# EAGLE design Pulse Ox PCB board (EAGLE 9.6.2)
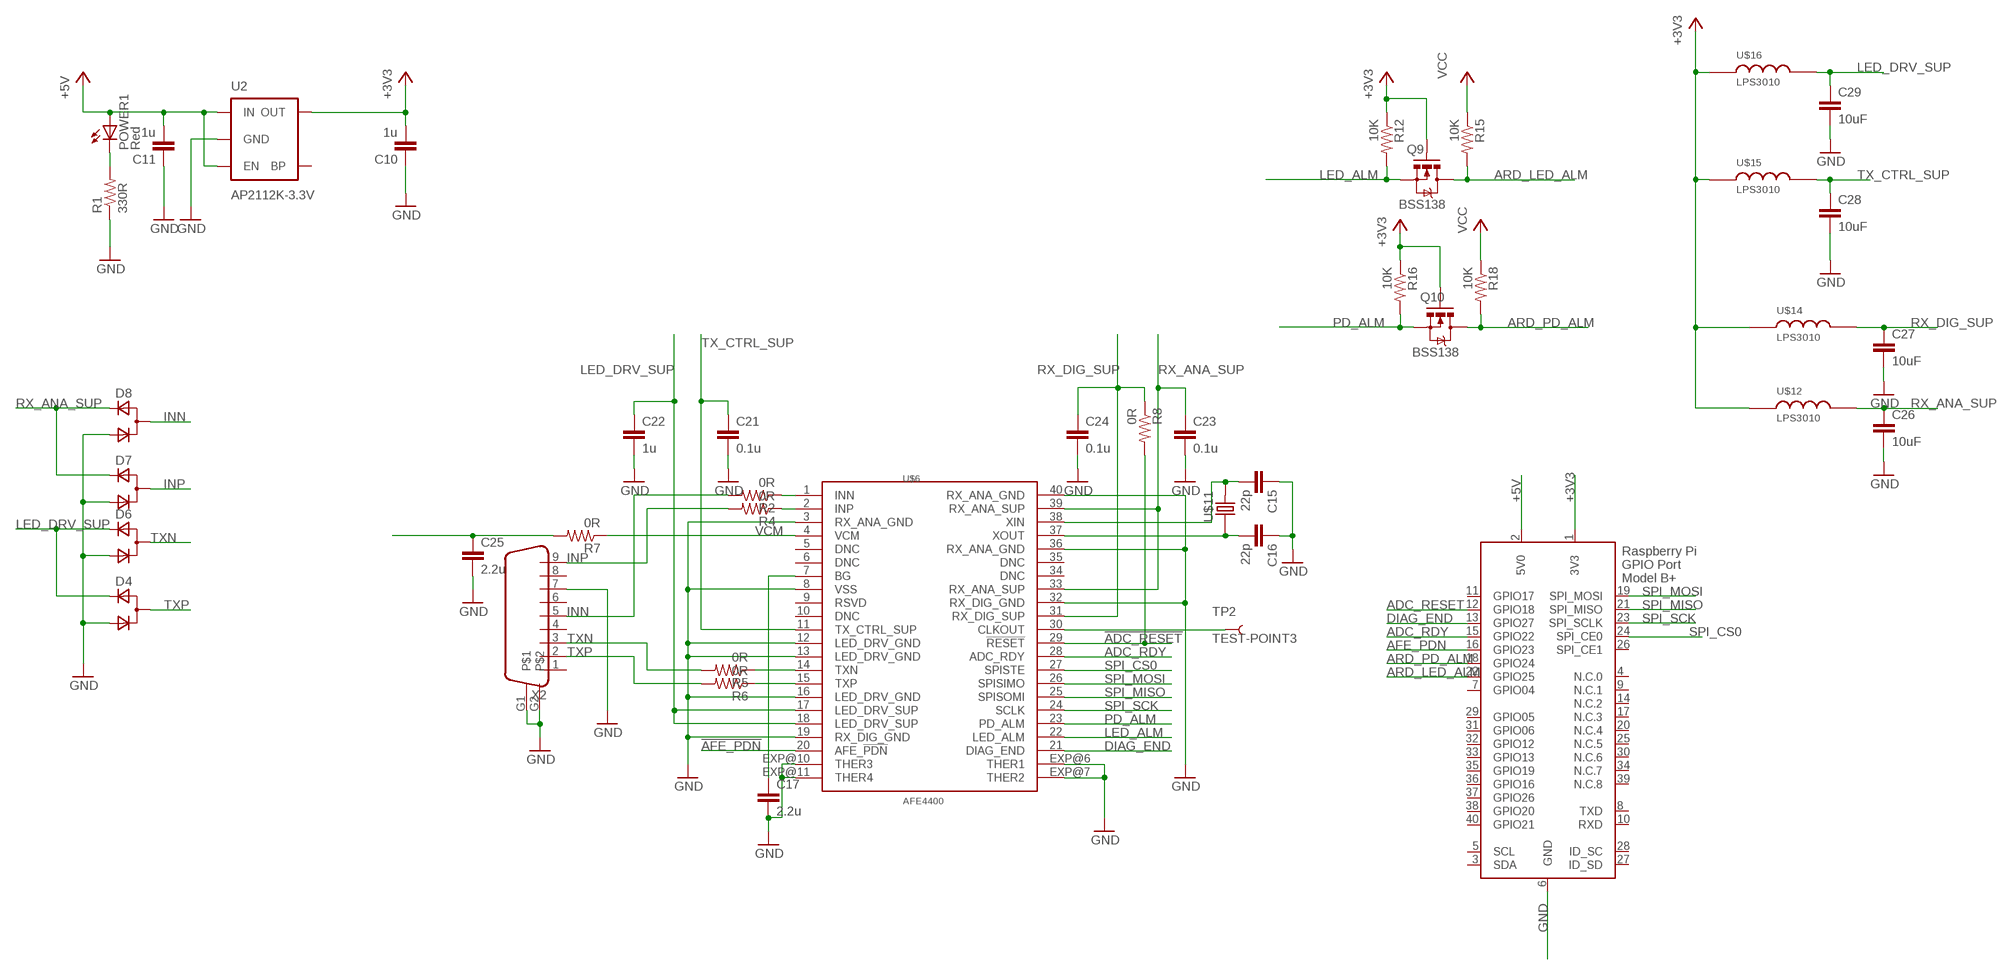
[diagram p0: schematic, sheet 1]

## Parts
C10  1u  C-EUC0805  [C0805]
C11  1u  C-EUC0805  [C0805]
C15  22p  C-EUC0402  [C0402]
C16  22p  C-EUC0402  [C0402]
C17  2.2u  C-EUC0402  [C0402]
C21  0.1u  C-EUC0805  [C0805]
C22  1u  C-EUC0805  [C0805]
C23  0.1u  C-EUC0805  [C0805]
C24  0.1u  C-EUC0805  [C0805]
C25  2.2u  C-EUC0402  [C0402]
C26  10uF  C-EUC0805  [C0805]
C27  10uF  C-EUC0805  [C0805]
C28  10uF  C-EUC0805  [C0805]
C29  10uF  C-EUC0805  [C0805]
D4  D_ACACSOT323  [SOT323]
D6  D_ACACSOT323  [SOT323]
D7  D_ACACSOT323  [SOT323]
D8  D_ACACSOT323  [SOT323]
POWER1  Red  LEDCHIPLED_0603  [CHIPLED_0603]
Q9  BSS138  MOSFET-NCHANNELSMD  [SOT23-3]
Q10  BSS138  MOSFET-NCHANNELSMD  [SOT23-3]
R1  330R  R-US_R0805  [R0805]
R2  0R  R-US_R0402  [R0402]
R4  0R  R-US_R0402  [R0402]
R5  0R  R-US_R0805  [R0805]
R6  0R  R-US_R0805  [R0805]
R7  0R  R-US_R0402  [R0402]
R8  0R  R-US_R0805  [R0805]
R12  10K  RESISTOR0805-RES  [0805]
R15  10K  RESISTOR0805-RES  [0805]
R16  10K  RESISTOR0805-RES  [0805]
R18  10K  RESISTOR0805-RES  [0805]
TP2  TEST-POINT3  [PAD.03X.03]
U2  AP2112K-3.3V  V_REG_LDOSMD  [SOT23-5]
U$6  AFE4400  [QFN-40]
U$11  ABM3  [ABM3]
U$12  LPS3010  LPS  [LPS]
U$14  LPS3010  LPS  [LPS]
U$15  LPS3010  LPS  [LPS]
U$16  LPS3010  LPS  [LPS]
X2  DB9  [DB9]
X3  RASPI_BOARD_B+_HD  [RASPI_BOARD_B+HAT_DF]

## Nets
!ADC_RESET: R8.2 U$6.29(!RESET)
!AFE_PDN: U$6.20(AFE_!PDN)
+3V3: C10.2 Q9.1(G) Q10.1(G) R12.1 R16.1 U2.5(OUT) U$12.1 U$14.1 U$15.1 U$16.1 X3.1(3V3)
+5V: C11.2 POWER1.A U2.1(IN) U2.3(EN) X3.2(5V0)
ADC_RDY: U$6.28(ADC_RDY) X3.15(GPIO22)
ADC_RESET: X3.12(GPIO18)
AFE_PDN: X3.16(GPIO23)
ARD_LED_ALM: Q9.3(D) R15.2 X3.22(GPIO25)
ARD_PD_ALM: Q10.3(D) R18.2 X3.18(GPIO24)
DIAG_END: U$6.21(DIAG_END) X3.13(GPIO27)
GND: C10.1 C11.1 C15.1 C16.1 C17.2 C21.2 C22.2 C23.2 C24.2 C25.2 C26.2 C27.2 C28.2 C29.2 D4.2(C) D6.2(C) D7.2(C) D8.2(C) R1.1 U2.2(GND) U$6.3(RX_ANA_GND) U$6.8(VSS) U$6.12(LED_DRV_GND) U$6.13(LED_DRV_GND) U$6.16(LED_DRV_GND) U$6.19(RX_DIG_GND) U$6.32(RX_DIG_GND) U$6.36(RX_ANA_GND) U$6.40(RX_ANA_GND) U$6.EXP@6(THER1) U$6.EXP@7(THER2) U$6.EXP@10(THER3) U$6.EXP@11(THER4) X2.7 X2.G1 X2.G2 X3.6(GND)
INN: D8.1(CA) R2.2 X2.5
INP: D7.1(CA) R4.2 X2.9
LED_ALM: Q9.2(S) R12.2 U$6.22(LED_ALM)
LED_DRV_SUP: C22.1 C29.1 D4.3(A) D6.3(A) U$6.17(LED_DRV_SUP) U$6.18(LED_DRV_SUP) U$16.2
N$15: POWER1.C R1.2
N$16: C15.2 U$6.38(XIN) U$11.2
N$19: C16.2 U$6.37(XOUT) U$11.1
N$20: C17.1 U$6.7(BG)
N$22: TP2.P$1 U$6.30(CLKOUT)
N$23: R2.1 U$6.1(INN)
N$24: R4.1 U$6.2(INP)
N$27: C25.1 R7.2
P14: R5.1 U$6.14(TXN)
P15: R6.1 U$6.15(TXP)
PD_ALM: Q10.2(S) R16.2 U$6.23(PD_ALM)
RX_ANA_SUP: C23.1 C26.1 D7.3(A) D8.3(A) U$6.33(RX_ANA_SUP) U$6.39(RX_ANA_SUP) U$12.2
RX_DIG_SUP: C24.1 C27.1 R8.1 U$6.31(RX_DIG_SUP) U$14.2
SPI_CS0: U$6.27(SPISTE) X3.24(SPI_CE0)
SPI_MISO: U$6.25(SPISOMI) X3.21(SPI_MISO)
SPI_MOSI: U$6.26(SPISIMO) X3.19(SPI_MOSI)
SPI_SCK: U$6.24(SCLK) X3.23(SPI_SCLK)
TX_CTRL_SUP: C21.1 C28.1 U$6.11(TX_CTRL_SUP) U$15.2
TXN: D6.1(CA) R5.2 X2.3
TXP: D4.1(CA) R6.2 X2.2
VCC: R15.1 R18.1
VCM: R7.1 U$6.4(VCM)
Unconnected: U2.4(BP) U$6.5(DNC) U$6.6(DNC) U$6.9(RSVD) U$6.10(DNC) U$6.34(DNC) U$6.35(DNC) X2.1 X2.4 X2.6 X2.8 X3.3(SDA) X3.4(N.C.0) X3.5(SCL) X3.7(GPIO04) X3.8(TXD) X3.9(N.C.1) X3.10(RXD) X3.11(GPIO17) X3.14(N.C.2) X3.17(N.C.3) X3.20(N.C.4) X3.25(N.C.5) X3.26(SPI_CE1) X3.27(ID_SD) X3.28(ID_SC) X3.29(GPIO05) X3.30(N.C.6) X3.31(GPIO06) X3.32(GPIO12) X3.33(GPIO13) X3.34(N.C.7) X3.35(GPIO19) X3.36(GPIO16) X3.37(GPIO26) X3.38(GPIO20) X3.39(N.C.8) X3.40(GPIO21)

## Library data of the parts
C10 C11 C15-C17 C21-C29 = rcl:C-EU: CAPACITOR, European symbol
D4 D6-D8 = zetex:D_ACAC: Dual DIODE; OC_FARNELL: unknown; OC_NEWARK: unknown
POWER1 = led:LED: LED OSRAM: - CHIPLED LG R971, LG N971, LY N971, LG Q971, LY Q971, LO R971, LY R971 LH N974, LH R974 LS Q976, LO Q976, LY Q976 LO Q996 - Hyper CHIPLED LW Q18S LB Q993, LB Q99A, LB R99A - SideLED LS A670, LO A670, LY A670, LG A670, LP A670 LB A673, LV A673, LT A673, LW A673 LH A674 LY A675 LS A676, LA A676, LO A676, LY A676, LW A676 LS A679, LY A679, LG A679 - Hyper Micro SIDELED® LS Y876, LA Y876, LO Y876, LY Y876 LT Y87S - SmartLED LW L88C, LW L88S LB L89C, LB L89S, LG L890 LS L89K, LO L89K, LY L89K LS L896, LA L896, LO L896, LY L896 - TOPLED LS T670, LO T670, LY T670, LG T670, LP T670 LSG T670, LSP T670, LSY T670, LOP T670, LYG T670 LG T671, LOG T671, LSG T671 LB T673, LV T673, LT T673, LW T673 LH T674 LS T676, LA T676, LO T676, LY T676, LB T676, LH T676, LSB T676, LW T676 LB T67C, LV T67C, LT T67C, LS T67K, LO T67K, LY T67K, LW E67C LS E67B, LA E67B, LO E67B, LY E67B, LB E67C, LV E67C, LT E67C LW T67C LS T679, LY T679, LG T679 LS T770, LO T770, LY T770, LG T770, LP T770 LB T773, LV T773, LT T773, LW T773 LH T774 LS E675, LA E675, LY E675, LS T675 LS T776, LA T776, LO T776, LY T776, LB T776 LHGB T686 LT T68C, LB T68C - Hyper Mini TOPLED® LB M676 - Mini TOPLED Santana® LG M470 LS M47K, LO M47K, LY M47K Source: http://www.osram.convergy.de LUXEON: - LUMILED® LXK2-PW12-R00, LXK2-PW12-S00, LXK2-PW14-U00, LXK2-PW14-V00 LXK2-PM12-R00, LXK2-PM12-S00, LXK2-PM14-U00 LXK2-PE12-Q00, LXK2-PE12-R00, LXK2-PE12-S00, LXK2-PE14-T00, LXK2-PE14-U00 LXK2-PB12-K00, LXK2-PB12-L00, LXK2-PB12-M00, LXK2-PB14-N00, LXK2-PB14-P00, LXK2-PB14-Q00 LXK2-PR12-L00, LXK2-PR12-M00, LXK2-PR14-Q00, LXK2-PR14-R00 LXK2-PD12-Q00, LXK2-PD12-R00, LXK2-PD12-S00 LXK2-PH12-R00, LXK2-PH12-S00 LXK2-PL12-P00, LXK2-PL12-Q00, LXK2-PL12-R00 Source: www.luxeon.com KINGBRIGHT: KA-3528ASYC Source: www.kingbright.com
Q9 Q10 = SparkFun:MOSFET-NCHANNEL
R1 R2 R4-R8 = rcl:R-US_: RESISTOR, American symbol
R12 R15 R16 R18 = SparkFun:RESISTOR: Resistor Basic schematic elements and footprints for 0603, 1206, and PTH resistors.
TP2 = SparkFun:TEST-POINT
U2 = SparkFun-PowerIC:V_REG_LDO: Voltage Regulator LDO Standard 150mA LDO voltage regulator in SOT-23 layout. Micrel part MIC5205. BP (by-pass) pin is used to lower output noise with 470pF cap.; PROD_ID: VREG-12457
U$6 = circuitects:AFE4400
U$11 = circuitects:ABM3
U$12 U$14-U$16 = circuitects:LPS
X2 = circuitects:DB9: DB9 Connector Standard DB9 (D-Sub 9) serial connector. Can be used for CAN bus as well as RS485 and RS232. Footprint production proven. Spark Fun Electronics SKU : PRT-00429
X3 = raspberrypi_bastelstube_v13:RASPI_BOARD_B+: Raspberry Pi GPIO connector with markings for the outer dimensions of the Raspberry Pi board model B+ with different sets of drill holes or mounting pads

## Board
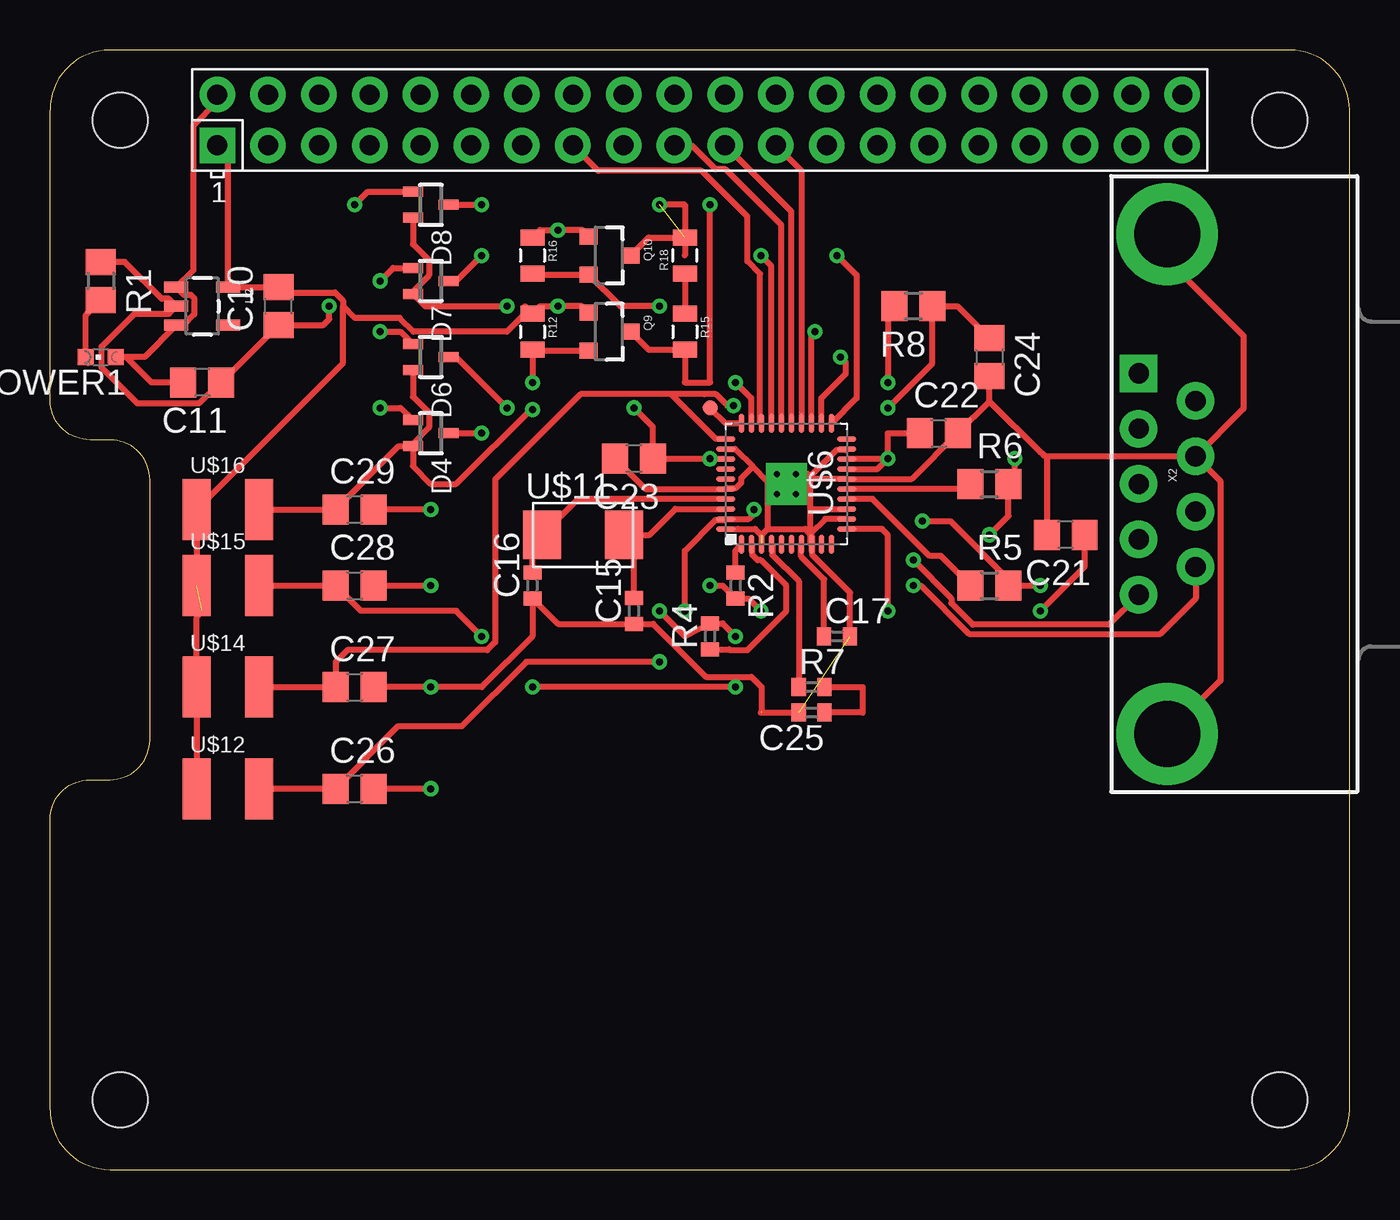
[diagram p1: board, top side]
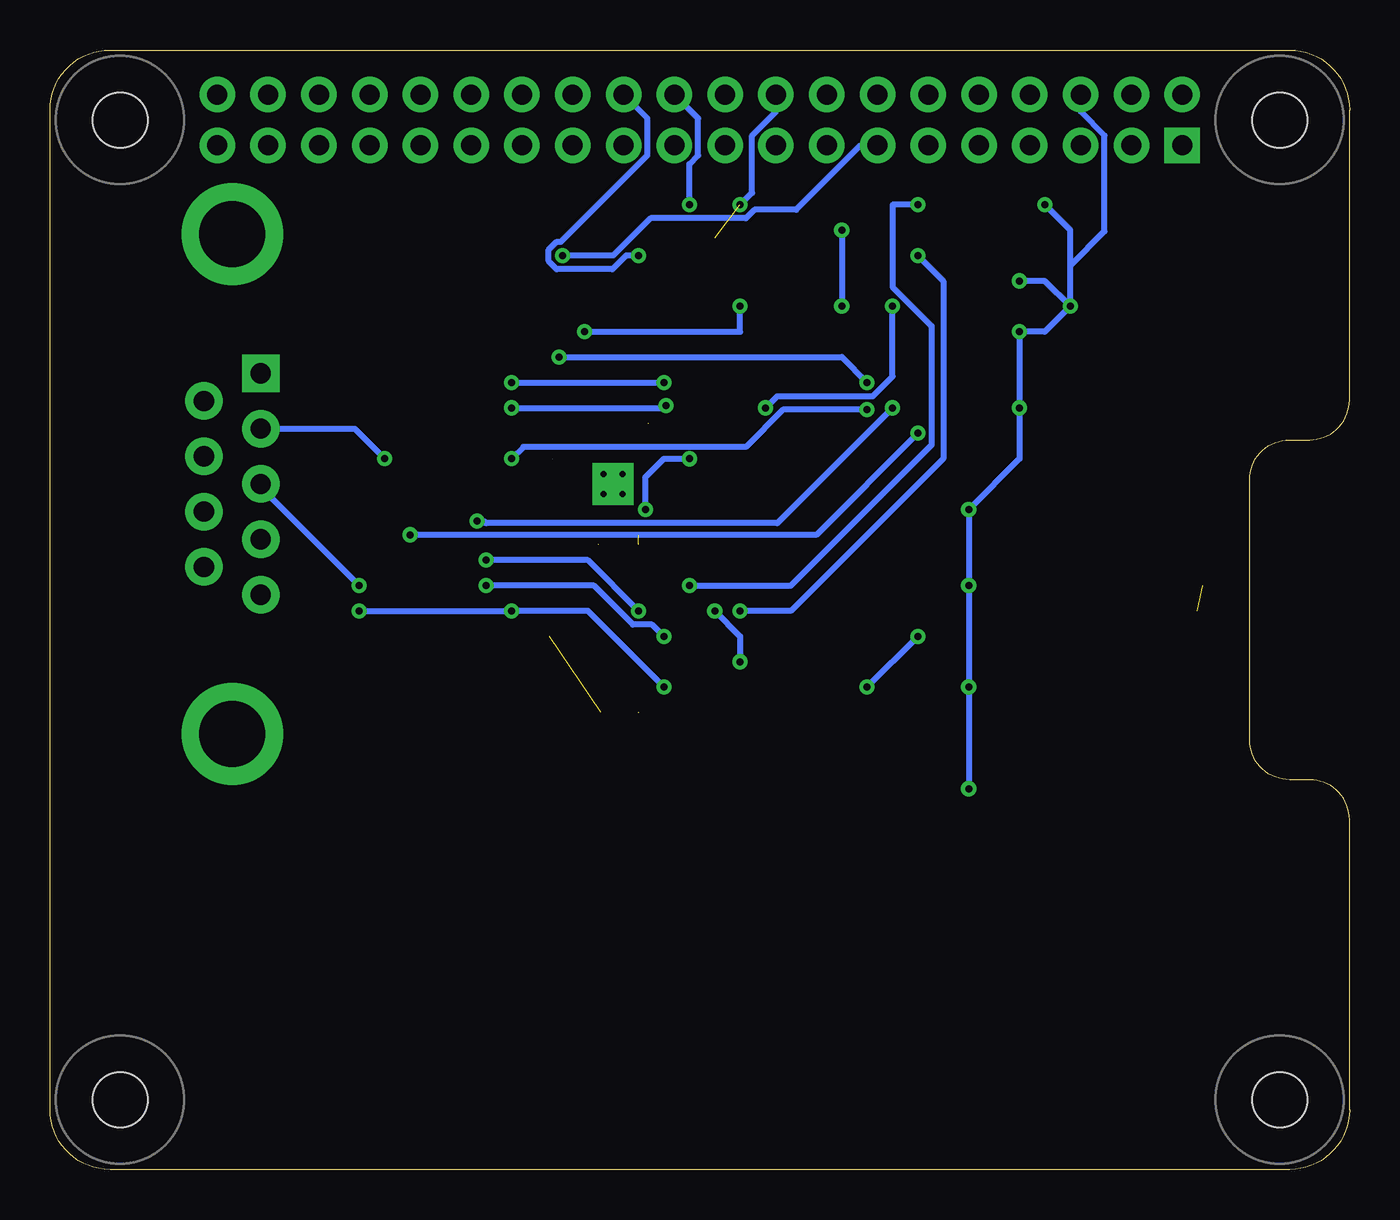
[diagram p2: board, bottom side, seen from below]

Size 65 x 56 mm. Coordinates in mm from the lower left corner, seen from the top.
Copper layers (1*16): Top 0.035mm / dielectric 1.5mm / Bottom 0.035mm
Design rules "default": minimum track width 6mil, minimum drill 0.35mm, track to track 6mil, track to pad 6mil, pad to pad 6mil, via to via 6mil, smd to smd 6mil, copper to edge 40mil, drill to drill 6mil, minimum pad ring 10mil, minimum via ring 8mil, stop-mask expansion 4mil, vias tented up to drill 0mil, thermal gap 10mil

### Footprints (pad centres in the part's own frame; a part is rotated, then mirrored left to right if it is on the bottom)
C0805 = smd 1.3 x 1.5: 1 -0.95,0; 2 0.95,0
C0402 = smd 0.7 x 0.9: 1 -0.65,0; 2 0.65,0
SOT323 = smd 0.5 x 1: 1 0,0.9; 2 -0.65,-0.9; 3 0.65,-0.9
CHIPLED_0603 = smd 0.8 x 0.8: A 0,-0.75; C 0,0.75
SOT23-3 = smd 0.8 x 0.9: 1 -0.95,-1; 2 0.95,-1; 3 0,1.1
R0805 = smd 1.3 x 1.5: 1 -0.95,0; 2 0.95,0
R0402 = smd 0.7 x 0.9: 1 -0.65,0; 2 0.65,0
0805 = smd 0.8 x 1.2: 1 -0.9,0; 2 0.9,0
PAD.03X.03 = smd 0.762 x 0.762: P$1 0,0
SOT23-5 = smd 0.55 x 1.2: 1 -0.95,-1.3; 2 0,-1.3; 3 0.95,-1.3; 4 0.95,1.3; 5 -0.95,1.3
QFN-40 = smd 0.95 x 0.28: 1 -3.025,2.25; 2 -3.025,1.75; 3 -3.025,1.25; 4 -3.025,0.75; 5 -3.025,0.25; 6 -3.025,-0.25; 7 -3.025,-0.75; 8 -3.025,-1.25; 9 -3.025,-1.75; 10 -3.025,-2.25; 21 3.025,-2.25; 22 3.025,-1.75; 23 3.025,-1.25; 24 3.025,-0.75; 25 3.025,-0.25; 26 3.025,0.25; 27 3.025,0.75; 28 3.025,1.25; 29 3.025,1.75; 30 3.025,2.25 | smd 0.28 x 0.95: 11 -2.25,-3.025; 12 -1.75,-3.025; 13 -1.25,-3.025; 14 -0.75,-3.025; 15 -0.25,-3.025; 16 0.25,-3.025; 17 0.75,-3.025; 18 1.25,-3.025; 19 1.75,-3.025; 20 2.25,-3.025; 31 2.25,3.025; 32 1.75,3.025; 33 1.25,3.025; 34 0.75,3.025; 35 0.25,3.025; 36 -0.25,3.025; 37 -0.75,3.025; 38 -1.25,3.025; 39 -1.75,3.025; 40 -2.25,3.025 | drill 0.3 pad 1.1 square: EXP@6 -0.5,0.475; EXP@7 0.5,0.475; EXP@10 -0.5,-0.475; EXP@11 0.5,-0.475
ABM3 = smd 1.9 x 2.4: 1 -2.05,0; 2 2.05,0
LPS = smd 1.4 x 3.05: 1 -1.56,0; 2 1.56,0
DB9 = drill 1.016 pad 1.88 square: 1 -5.54,-1.42 | drill 1.016 pad 1.88: 2 -2.77,-1.42; 3 0,-1.42; 4 2.77,-1.42; 5 5.54,-1.42; 6 -4.15,1.42; 7 -1.38,1.42; 8 1.38,1.42; 9 4.15,1.42 | drill 3.302 pad 5.08: G1 -12.5,0; G2 12.5,0
RASPI_BOARD_B+HAT_DF = drill 1 pad 1.778 square: 1 8.37,51.23 | drill 1 pad 1.778: 2 8.37,53.77; 3 10.91,51.23; 4 10.91,53.77; 5 13.45,51.23; 6 13.45,53.77; 7 15.99,51.23; 8 15.99,53.77; 9 18.53,51.23; 10 18.53,53.77; 11 21.07,51.23; 12 21.07,53.77; 13 23.61,51.23; 14 23.61,53.77; 15 26.15,51.23; 16 26.15,53.77; 17 28.69,51.23; 18 28.69,53.77; 19 31.23,51.23; 20 31.23,53.77; 21 33.77,51.23; 22 33.77,53.77; 23 36.31,51.23; 24 36.31,53.77; 25 38.85,51.23; 26 38.85,53.77; 27 41.39,51.23; 28 41.39,53.77; 29 43.93,51.23; 30 43.93,53.77; 31 46.47,51.23; 32 46.47,53.77; 33 49.01,51.23; 34 49.01,53.77; 35 51.55,51.23; 36 51.55,53.77; 37 54.09,51.23; 38 54.09,53.77; 39 56.63,51.23; 40 56.63,53.77 | hole 2.75: 3.5,3.5; 3.5,52.5; 61.5,3.5; 61.5,52.5

### Placement (x,y rotation side)
C10  11.43,43.18 90 top
C11  7.62,39.37 180 top
C15  29.21,27.94 90 top
C16  24.13,29.21 90 top
C17  39.37,26.67 0 top
C21  50.8,31.75 180 top
C22  44.45,36.83 0 top
C23  29.21,35.56 180 top
C24  46.99,40.64 270 top
C25  38.1,22.86 180 top
C26  15.24,19.05 0 top
C27  15.24,24.13 0 top
C28  15.24,29.21 0 top
C29  15.24,33.02 0 top
D4  19.05,36.83 270 top
D6  19.05,40.64 270 top
D7  19.05,44.45 270 top
D8  19.05,48.26 270 top
POWER1  2.54,40.64 90 top
Q9  27.94,41.91 270 top
Q10  27.94,45.72 270 top
R1  2.54,44.45 270 top
R2  34.29,29.21 270 top
R4  33.02,26.67 90 top
R5  46.99,29.21 0 top
R6  46.99,34.29 0 top
R7  38.1,24.13 0 top
R8  43.18,43.18 180 top
R12  24.13,41.91 270 top
R15  31.75,41.91 270 top
R16  24.13,45.72 270 top
R18  31.75,45.72 90 top
TP2  33.02,38.1 0 top
U2  7.62,43.18 270 top
U$6  36.83,34.29 90 top
U$11  26.67,31.75 0 top
U$12  8.89,19.05 0 top
U$14  8.89,24.13 0 top
U$15  8.89,29.21 0 top
U$16  8.89,33.02 0 top
X2  55.88,34.29 270 top
X3  0,0 0 top

### Tracks (layer width: path | path; a pad name or v marks a point on that pad's centre or on a via)
!ADC_RESET  (via drill 0.35)  (1 unrouted)
  Top 0.305: v34.29,39.37 35.07,38.59 35.07,37.31 | R8.2 41.91,42.86 v41.91,39.37
  Bottom 0.305: v41.91,39.37 v34.29,39.37
+3V3  (via drill 0.35)  (1 unrouted)
  Top 0.305: X3.1 8.92,50.68 U2.5 C10.2 11.7,43.86 14.25,43.86 14.65,43.46 14.65,43.18 | U$15.1 U$16.1 14.65,40.34 14.65,43.18 | 7.62,27.94 7.33,27.65 U$14.1 U$12.1 | Q10.1 26.62,46.99 v25.4,46.99 24.5,46.99 R16.1 | Q9.1 26.62,43.18 v25.4,43.18 24.5,43.18 R12.1 | R12.1 23.76,43.18 | R12.1 23.76,42.81 22.86,41.91 18.18,41.91 17.49,42.59 15.24,42.59 14.65,43.18
  Bottom 0.305: v25.4,46.99 v25.4,43.18
+5V
  Top 0.305: X3.2 8.37,53.44 7.18,52.24 7.18,44.99 U2.1 6.69,43.76 7.05,43.76 7.23,43.58 7.23,42.78 6.68,42.23 U2.3 4.73,40.64 3.81,40.64 | 3.81,40.64 POWER1.A | C11.2 5.08,39.37 3.81,40.64
ADC_RDY
  Top 0.305: U$6.28 35.52,37.37 35.52,44.79 34.88,45.44 34.88,47.67 32.59,49.96 27.42,49.96 X3.15
ARD_LED_ALM  (via drill 0.35)
  Top 0.305: Q9.3 29.94,41.01 R15.2 31.75,39.37 33.02,39.37 v33.02,48.26
  Bottom 0.305: v33.02,48.26 33.02,50.29 32.58,50.74 32.58,52.58 X3.22
ARD_PD_ALM  (via drill 0.35)  (1 unrouted)
  Top 0.305: Q10.3 29.94,46.62 R18.2 | R18.2 31.75,45.72 | v30.48,48.26 31.75,48.26 R18.2
  Bottom 0.305: v30.48,48.26 29.88,48.86 29.88,51.72 28.69,52.92 X3.18
DIAG_END  (via drill 0.35)
  Top 0.305: v39.37,45.72 40.35,44.74 40.35,38.58 U$6.21
  Bottom 0.305: X3.13 24.46,51.23 27.69,48.01 29.77,48.01 30.2,47.58 34.97,47.58 36.83,45.72 v39.37,45.72
GND  (via drill 0.35)  (4 unrouted)
  Top 0.305: R1.1 3.74,45.4 5.59,43.55 5.95,43.55 U2.2 5.95,42.81 4.23,42.81 2.58,41.17 2.58,40.11 4.38,38.31 7.45,38.31 8.5,39.37 C11.1 C10.1 13.65,42.23 13.97,42.55 v13.97,43.18 | v15.24,48.26 15.89,48.91 D8.2 | v16.51,44.45 17.16,45.1 D7.2 | v16.51,41.91 17.53,41.91 D6.2 | v16.51,38.1 17.53,38.1 D4.2 | v19.05,33.02 C29.2 | C27.2 v19.05,24.13 21.59,24.13 24.13,26.67 C16.1 25.4,27.29 C15.1 30.16,27.29 32.81,24.64 35.08,24.64 35.59,24.13 35.59,22.89 | v19.05,19.05 C26.2 | 38.02,31.78 37.76,32.05 35.9,32.05 | 38.02,31.78 38.02,31.75 | 38.02,31.75 38.02,31.32 U$6.8 | 35.59,31.74 35.9,32.05 | 35.16,35.16 35.9,34.41 | 35.9,34.41 35.9,34.25 | 35.9,34.25 35.9,32.05 | U$6.19 39.8,35.98 39.34,35.98 38.02,34.67 | 38.02,34.67 38.02,34.29 | 38.02,34.29 38.02,33.02 | 38.02,33.02 38.02,31.78 | U$6.12 38.78,32.54 38.02,31.78 | U$6.13 39.83,33.02 38.02,33.02 | 38.02,34.67 38.16,34.54 U$6.16 43.11,34.54 C22.2 46.99,38.42 | C25.2 35.56,22.86 | 38.02,31.75 38.14,31.64 38.14,30.75 40.02,28.86 C17.2 | 35.16,35.16 34.59,34.58 34.59,34.36 34.32,34.09 33.86,34.09 U$6.36 29.78,34.04 C23.2 | U$6.32 34.27,36.04 35.16,35.16 | 46.99,38.42 C24.2 | 46.99,38.42 49.53,35.88 49.69,35.76 | C21.2 49.85,35.63 49.69,35.76 | C28.2 v19.05,29.21 | X2.7 49.77,35.67 49.69,35.76 | X2.G1 55.88,45.52 58.32,43.08 58.42,42.98 59.69,41.71 59.69,38.06 X2.7 | X2.G2 58.55,24.46 58.55,34.42 X2.7 | U$6.40 34.39,32.04 34.4,32.05 35.26,32.05 35.59,31.72 35.59,31.27 | U$6.EXP@7 35.98,34.41 35.9,34.41 | U$6.EXP@6 35.9,34.25 | U$6.EXP@11 37.91,34.79 38.02,34.67 | U$6.EXP@10 37.52,33.79 38.02,34.29
  Bottom 0.305: X3.6 13.45,52.92 12.26,51.72 12.26,46.93 13.97,45.21 v13.97,43.18 | v13.97,43.18 13.97,46.99 v15.24,48.26 | v13.97,43.18 15.24,44.45 v16.51,44.45 | v13.97,43.18 15.24,41.91 v16.51,41.91 v16.51,38.1 16.51,35.56 v19.05,33.02 v19.05,29.21 v19.05,24.13 v19.05,19.05
INN  (via drill 0.35)
  Top 0.305: D8.1 v21.59,48.26 | v33.02,29.21 33.64,29.21 R2.2 34.94,28.56 v35.56,27.94 | X2.5 52.97,27.26 46.16,27.26 45.08,28.33 45.08,28.57 v43.18,30.48
  Bottom 0.305: v33.02,29.21 27.94,29.21 20.91,36.24 20.91,42.19 22.86,44.15 22.86,48.26 v21.59,48.26 | v35.56,27.94 38.1,30.48 v43.18,30.48
INP  (via drill 0.35)
  Top 0.305: v30.48,27.94 31.75,26.67 R4.2 33.64,27.32 v34.29,26.67 | v21.59,45.72 20.32,44.45 D7.1 | X2.9 57.3,28.56 55.54,26.8 45.97,26.8 43.56,29.21 v43.18,29.21
  Bottom 0.305: v21.59,45.72 20.32,44.45 20.32,35.56 27.94,27.94 v30.48,27.94 | v34.29,26.67 34.88,27.26 35.84,27.26 37.8,29.21 v43.18,29.21
LED_ALM  (via drill 0.35)
  Top 0.305: Q9.2 24.18,40.96 R12.2 v24.13,39.37 | v39.53,40.64 39.8,40.38 39.8,39.8 38.58,38.58 U$6.22
  Bottom 0.305: v24.13,39.37 25.4,40.64 v39.53,40.64
LED_DRV_SUP  (via drill 0.35)  (1 unrouted)
  Top 0.305: U$16.2 C29.1 17.45,36.18 D4.3 | D4.3 18.15,36.3 18.95,37.1 18.95,37.86 18.15,38.66 D6.3 | D4.3 18.15,35.19 19.05,34.29 20.32,34.29 24.13,38.1 v24.13,38 | v41.91,35.56 41.88,35.53 39.86,35.53 | U$6.17 41.39,35.04 v41.91,35.56 | v41.91,35.56 41.91,36.83 C22.1
  Bottom 0.305: v24.13,38 28.34,38 30.2,36.15 41.32,36.15 v41.91,35.56
N$15
  Top 0.305: POWER1.C 1.79,42.75 R1.2
N$16
  Top 0.305: U$11.2 29.21,31.75 | 29.21,31.75 29.99,31.75 31.28,33.04 U$6.38 | C15.2 29.21,31.75
N$19
  Top 0.305: U$6.37 26.41,33.54 U$11.1 24.13,31.26 C16.2
N$20  (1 unrouted)
  Top 0.305: C17.1 38.72,29.51 37.57,30.67 37.57,31.27
N$22
  Top 0.305: U$6.30 33.8,37.31 TP2.P$1
N$23
  Top 0.305: R2.1 34.29,30.97 U$6.1
N$24
  Top 0.305: U$6.2 35.13,31.21 35.13,30.75 35.4,30.49 35.55,30.49 36.83,29.21 36.83,27.94 34.88,25.99 34.01,25.99 33.97,26.02 R4.1
N$27
  Top 0.305: R7.2 40.64,24.13 40.64,22.86 C25.1
P14
  Top 0.305: R5.1 44.55,30.7 43.99,30.7 41.15,33.54 U$6.14
P15
  Top 0.305: R6.1 45.79,34.04 U$6.15
PD_ALM  (via drill 0.35)
  Top 0.305: U$6.23 38.08,41.89 38.1,41.91 v38.26,41.91 | v30.48,43.18 28.53,43.18 Q10.2 24.18,44.77 R16.2
  Bottom 0.305: v38.26,41.91 30.48,41.91 v30.48,43.18
RX_ANA_SUP  (via drill 0.35)
  Top 0.305: U$12.2 C26.1 17.42,22.18 20.6,22.18 23.83,25.4 v30.48,25.4 | D8.3 18.15,46.28 18.95,45.48 18.95,44.72 18.15,43.92 D7.3 18.77,43.18 v22.86,43.18 | U$6.33 33.78,35.56 v33.02,35.56 v33.01,35.55 C23.1 30.16,37.15 v29.21,38.1 | v35.21,33.02 35.44,33.02 34.96,32.54 U$6.39 33.76,32.5 33.3,32.5 31.75,30.95 v31.75,27.94
  Bottom 0.305: v29.21,38.1 28.62,38.69 23.85,38.69 22.86,39.67 v22.86,43.18 | v31.75,27.94 30.48,26.67 v30.48,25.4 | v35.21,33.02 35.21,34.64 34.29,35.56 v33.02,35.56 v33.01,35.55
RX_DIG_SUP  (via drill 0.35)
  Top 0.305: U$14.2 C27.1 14.29,25.4 14.88,25.99 21.87,25.99 22.27,26.39 22.27,34.52 26.53,38.78 31.07,38.78 | U$6.31 33.31,36.54 31.07,38.78 | v34.19,38.2 33.89,38.2 33.3,38.79 32.74,38.79 32.73,38.78 31.07,38.78 | v41.91,38.1 44.13,40.32 R8.1 45.4,43.18 C24.1
  Bottom 0.305: v41.91,38.1 34.29,38.1 v34.19,38.2
SPI_CS0  (via drill 0.35)
  Top 0.305: U$6.27 36.08,45.2 v35.56,45.72
  Bottom 0.305: v35.56,45.72 36.18,45.72 36.87,45.04 39.65,45.04 40.05,45.44 40.05,46 39.65,46.4 39.45,46.4 35.12,50.74 35.12,52.58 X3.24
SPI_MISO
  Top 0.305: U$6.25 37.08,47.92 X3.21
SPI_MOSI
  Top 0.305: U$6.26 36.58,45.72 36.58,45.88 36.58,47.24 33.78,50.04 33.28,50.04 32.08,51.23 X3.19
SPI_SCK
  Top 0.305: X3.23 37.58,49.96 U$6.24
TX_CTRL_SUP  (via drill 0.35)
  Top 0.305: U$15.2 C28.1 15.56,27.94 20.32,27.94 v21.59,26.67 | v41.91,27.94 41.91,31.75 41.62,32.04 U$6.11 | v34.29,24.13 v24.13,24.13 | v49.53,27.94 51.75,30.16 C21.1
  Bottom 0.305: v24.13,24.13 v21.59,26.67 | v34.29,24.13 38.1,27.94 v41.91,27.94 v49.53,27.94
TXN  (via drill 0.35)
  Top 0.305: D6.1 20.32,40.64 v22.86,38.1 | 48.26,29.53 48.1,29.37 | 48.1,29.37 R5.2 v49.53,29.21 | v43.63,32.43 45.04,32.43 48.1,29.37
  Bottom 0.305: v22.86,38.1 28.62,32.34 43.18,32.34 | 43.18,32.34 43.63,32.34 | 43.18,32.34 43.28,32.43 v43.63,32.43 | v49.53,29.21 54.46,34.14 X2.3
TXP  (via drill 0.35)
  Top 0.305: D4.1 v21.59,36.83 | v46.99,31.75 47.94,32.7 R6.2 48.26,34.61 v48.26,35.56
  Bottom 0.305: v21.59,36.83 26.67,31.75 v46.99,31.75 | X2.2 49.76,37.06 v48.26,35.56
VCC
  Top 0.305: R18.1 R15.1
VCM
  Top 0.305: U$6.4 36.13,31.21 36.13,30.75 37.45,29.43 R7.1